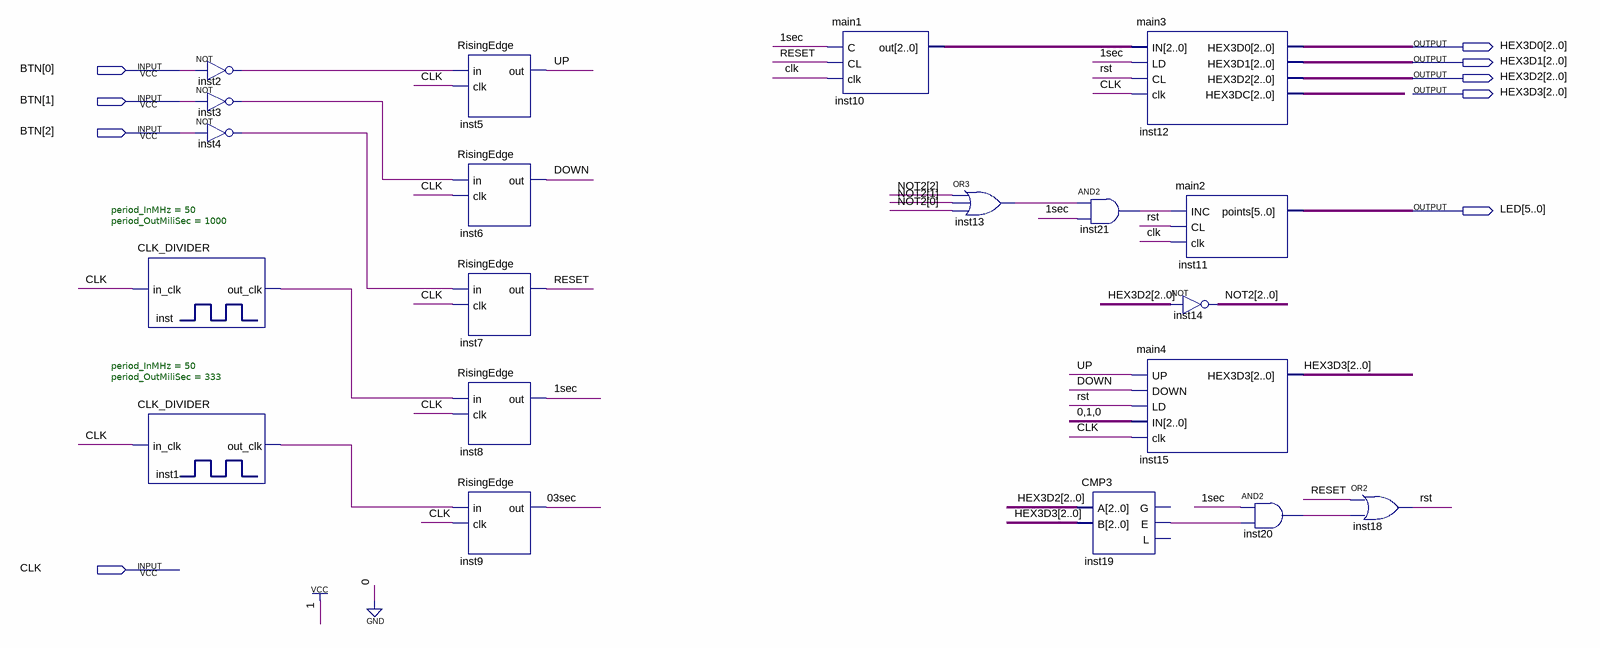
[diagram p0: schematic sheet]
// Quartus schematic main5.bdf as structural Verilog: 20 symbols, 9 pins
module main5 (
  input  [2:0] BTN,
  input  CLK,
  output [2:0] HEX3D0,
  output [2:0] HEX3D1,
  output [2:0] HEX3D2,
  output [2:0] HEX3D3,
  output [5:0] LED
);

  wire \1sec , \03sec , DOWN, inst1_out_clk, inst2_out, inst3_out, inst4_out, inst13_out, inst19_e,
       inst20_out, inst21_out, inst_out_clk, RESET, rst, UP;
  wire [2:0] inst10_out, inst12_hex3dc, NOT2;

  CLK_DIVIDER #(.period_InMHz(50), .period_OutMiliSec(1000)) inst (.in_clk(CLK), .out_clk(inst_out_clk));
  CLK_DIVIDER #(.period_InMHz(50), .period_OutMiliSec(333)) inst1 (.in_clk(CLK), .out_clk(inst1_out_clk));
  not inst2 (inst2_out, BTN[0]);
  not inst3 (inst3_out, BTN[1]);
  not inst4 (inst4_out, BTN[2]);
  RisingEdge inst5 (.in(inst2_out), .clk(CLK), .out(UP));
  RisingEdge inst6 (.in(inst3_out), .clk(CLK), .out(DOWN));
  RisingEdge inst7 (.in(inst4_out), .clk(CLK), .out(RESET));
  RisingEdge inst8 (.in(inst_out_clk), .clk(CLK), .out(\1sec ));
  RisingEdge inst9 (.in(inst1_out_clk), .clk(CLK), .out(\03sec ));
  main1 inst10 (.C(\1sec ), .CL(RESET), .clk(CLK), .out(inst10_out));
  or inst13 (inst13_out, NOT2[2], NOT2[1], NOT2[0]);
  and inst21 (inst21_out, inst13_out, \1sec );
  CMP3 inst19 (.A(HEX3D2), .B(HEX3D3), .E(inst19_e));  // open: G, L
  main3 inst12 (
    .IN(inst10_out), .LD(\1sec ), .CL(rst), .clk(CLK), .HEX3D0(HEX3D0), .HEX3D1(HEX3D1), .HEX3D2(HEX3D2),
    .HEX3DC(inst12_hex3dc));
  main4 inst15 (.UP(UP), .DOWN(DOWN), .LD(rst), .IN(3'b010), .clk(CLK), .HEX3D3(HEX3D3));
  main2 inst11 (.INC(inst21_out), .CL(rst), .clk(CLK), .points(LED));
  assign NOT2 = ~HEX3D2;  // NOT inst14, 3 bits wide
  and inst20 (inst20_out, \1sec , inst19_e);
  or inst18 (rst, RESET, inst20_out);
endmodule
